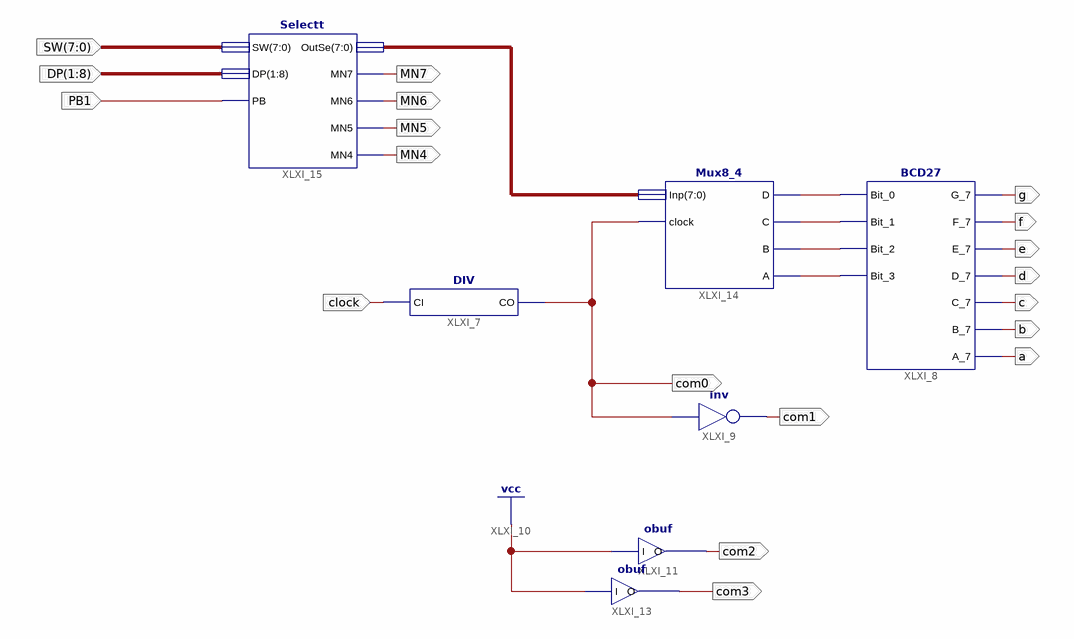
[diagram p0: schematic sheet 1]
// Xilinx ISE schematic lab9.sch (spartan6) as structural Verilog: 7 symbols, 19 ports
module lab9 (
  input  clock,
  input  [7:0] SW,
  input  [1:8] DP,
  input  PB1,
  output com0,
  output g,
  output f,
  output e,
  output d,
  output c,
  output b,
  output a,
  output com1,
  output com2,
  output com3,
  output MN7,
  output MN6,
  output MN5,
  output MN4
);

  wire XLXN_9, XLXN_10, XLXN_11, XLXN_12;
  wire [7:0] XLXN_26;

  DIV XLXI_7 (.CI(clock), .CO(com0));
  BCD27 XLXI_8 (
    .Bit_0(XLXN_9), .Bit_1(XLXN_10), .Bit_2(XLXN_11), .Bit_3(XLXN_12), .G_7(g), .F_7(f), .E_7(e), .D_7(d),
    .C_7(c), .B_7(b), .A_7(a));
  not XLXI_9 (com1, com0);
  obuf XLXI_11 (.I(1'b1), .O(com2));
  obuf XLXI_13 (.I(1'b1), .O(com3));
  Mux8_4 XLXI_14 (.A(XLXN_12), .B(XLXN_11), .C(XLXN_10), .clock(com0), .D(XLXN_9), .Inp(XLXN_26));
  Selectt XLXI_15 (.DP(DP), .MN4(MN4), .MN5(MN5), .MN6(MN6), .MN7(MN7), .OutSe(XLXN_26), .PB(PB1), .SW(SW));
endmodule
